# EAGLE design usb2rs232esp (EAGLE 6.6.0)
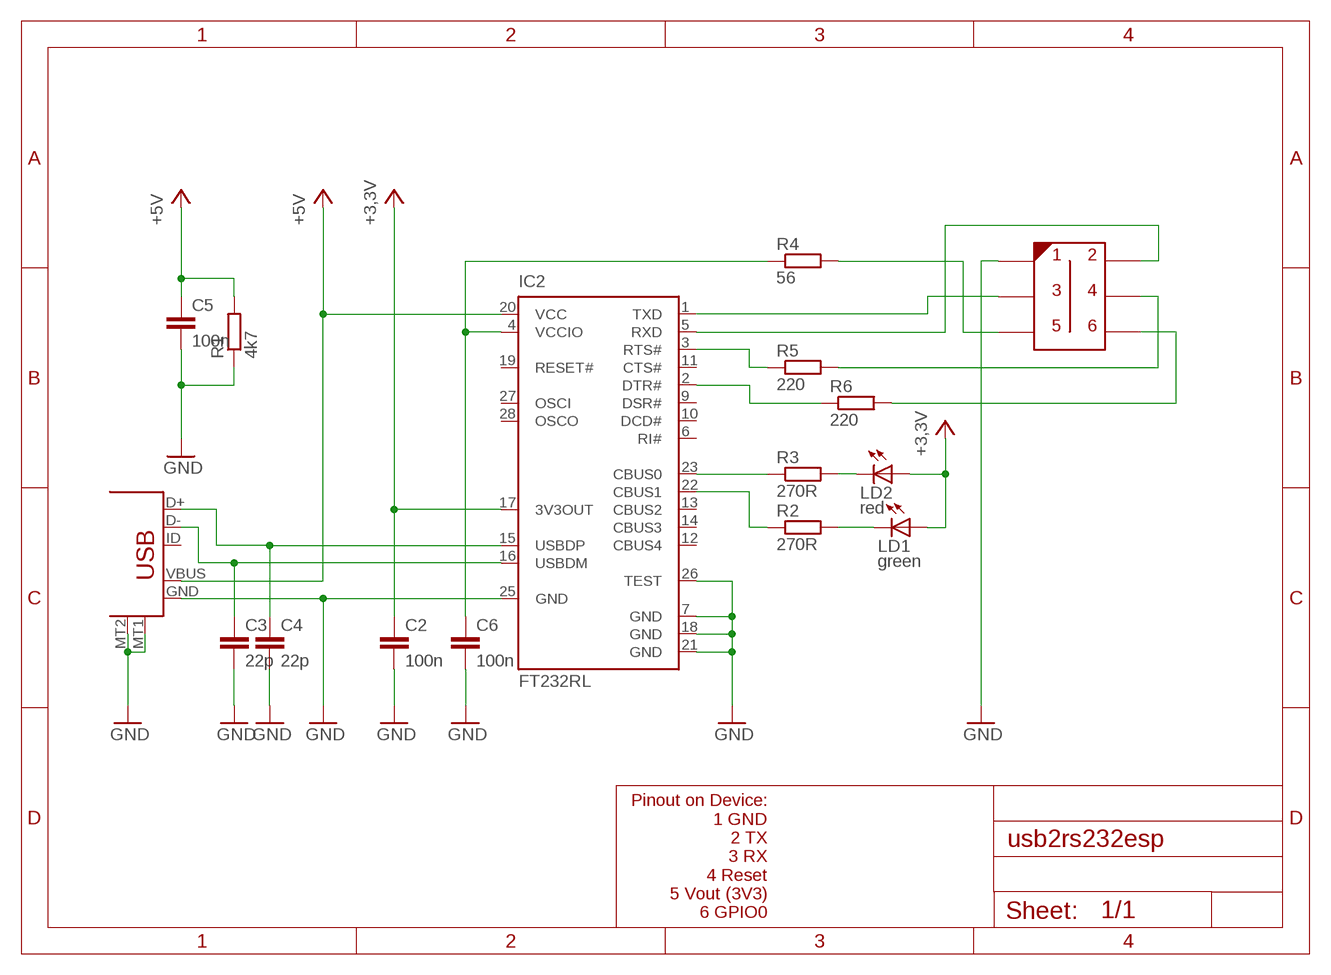
[diagram p0: schematic, sheet 1]

## Parts
C2  100n  C-EUC0603  [C0603]
C3  22p  C-EUC0603  [C0603]
C4  22p  C-EUC0603  [C0603]
C5  100n  C-EUC0603  [C0603]
C6  100n  C-EUC0603  [C0603]
IC2  FT232RL  [SSOP28]
LD1  green  LEDCHIP-LED0603  [CHIP-LED0603]
LD2  red  LEDCHIP-LED0603  [CHIP-LED0603]
R1  4k7  R-EU_R0603  [R0603]
R2  270R  R-EU_R0603  [R0603]
R3  270R  R-EU_R0603  [R0603]
R4  56  R-EU_R0603  [R0603]
R5  220  R-EU_R0603  [R0603]
R6  220  R-EU_R0603  [R0603]
U$3  AVR-ISP-6-EDGE  [6PAD_ISP]
U$40  USB-B  [USB-MICROB]

## Nets
+3,3V: C2.1 IC2.17(3V3OUT) LD1.A LD2.A
+5V [pwr]: C5.1 IC2.20(VCC) R1.2 U$40.VBUS
GND [pwr]: C2.2 C3.2 C4.2 C5.2 C6.2 IC2.7(GND) IC2.18(GND) IC2.21(GND) IC2.25(GND) IC2.26(TEST) R1.1 U$3.MISO U$40.GND U$40.MT1 U$40.MT2
N$1: IC2.23(CBUS0) R3.1
N$2: IC2.22(CBUS1) R2.1
N$3: C4.1 IC2.15(USBDP) U$40.D+
N$4: C3.1 IC2.16(USBDM) U$40.D-
N$5: C6.1 IC2.4(VCCIO) R4.1
N$6: LD1.C R2.2
N$7: LD2.C R3.2
N$8: R4.2 U$3.RST
N$9: R5.2 U$3.MOSI
N$10: R6.2 U$3.GND
N$11: IC2.5(RXD) U$3.VCC
N$12: IC2.1(TXD) U$3.SCK
N$13: IC2.3(RTS#) R5.1
N$14: IC2.2(DTR#) R6.1
Unconnected: IC2.6(RI#) IC2.9(DSR#) IC2.10(DCD#) IC2.11(CTS#) IC2.12(CBUS4) IC2.13(CBUS2) IC2.14(CBUS3) IC2.19(RESET#) IC2.27(OSCI) IC2.28(OSCO) U$40.ID

## Notes on the sheet
- 1 | 2
- 3 | 4
- 5 | 6
- Pinout on Device:
  1 GND
  2 TX
  3 RX
  4 Reset
  5 Vout (3V3)
  6 GPIO0

## Library data of the parts
C2-C6 = rcl:C-EU: CAPACITOR, European symbol
IC2 = ftdichip:FT232R: Source: http://www.ftdichip.com/Documents/DataSheets/DS_FT232R_v104.pdf
LD1 LD2 = led:LED: LED OSRAM: - CHIPLED LG R971, LG N971, LY N971, LG Q971, LY Q971, LO R971, LY R971 LH N974, LH R974 LS Q976, LO Q976, LY Q976 LO Q996 - Hyper CHIPLED LW Q18S LB Q993, LB Q99A, LB R99A - SideLED LS A670, LO A670, LY A670, LG A670, LP A670 LB A673, LV A673, LT A673, LW A673 LH A674 LY A675 LS A676, LA A676, LO A676, LY A676, LW A676 LS A679, LY A679, LG A679 - Hyper Micro SIDELED® LS Y876, LA Y876, LO Y876, LY Y876 LT Y87S - SmartLED LW L88C, LW L88S LB L89C, LB L89S, LG L890 LS L89K, LO L89K, LY L89K LS L896, LA L896, LO L896, LY L896 - TOPLED LS T670, LO T670, LY T670, LG T670, LP T670 LSG T670, LSP T670, LSY T670, LOP T670, LYG T670 LG T671, LOG T671, LSG T671 LB T673, LV T673, LT T673, LW T673 LH T674 LS T676, LA T676, LO T676, LY T676, LB T676, LH T676, LSB T676, LW T676 LB T67C, LV T67C, LT T67C, LS T67K, LO T67K, LY T67K, LW E67C LS E67B, LA E67B, LO E67B, LY E67B, LB E67C, LV E67C, LT E67C LW T67C LS T679, LY T679, LG T679 LS T770, LO T770, LY T770, LG T770, LP T770 LB T773, LV T773, LT T773, LW T773 LH T774 LS E675, LA E675, LY E675, LS T675 LS T776, LA T776, LO T776, LY T776, LB T776 LHGB T686 LT T68C, LB T68C - Hyper Mini TOPLED® LB M676 - Mini TOPLED Santana® LG M470 LS M47K, LO M47K, LY M47K Source: http://www.osram.convergy.de/
R1-R6 = rcl:R-EU_: RESISTOR, European symbol
U$3 = avr-7:AVR-ISP-6-EDGE: 6 pin edge connector for ISP with ATMEL MCUs. Developed by Craig Moates (craig at moates dot net). Library by David Blundell (blundar at gmail dot com). Often, even a 6 pin header is really inconvenient for board layout and/or production. This SMD-only header is our de-facto standard for using an edge connector for programming with the help of a 6pin/10pin to edge card adapter.
U$40 = sid:USB-B

## Net classes
0 default: width 0.152 mm, drill 0.305 mm, clearance 0.152 mm
1 pwr: width 0.152 mm, drill 0.305 mm, clearance 0.152 mm

## Board
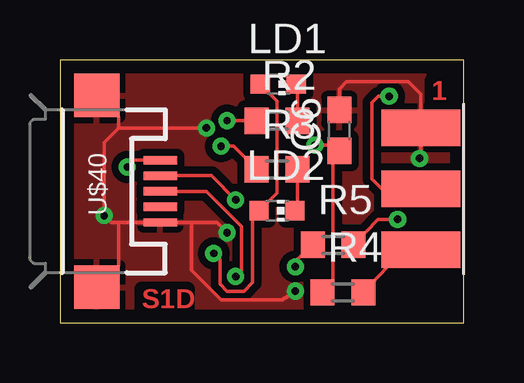
[diagram p1: board, top side]
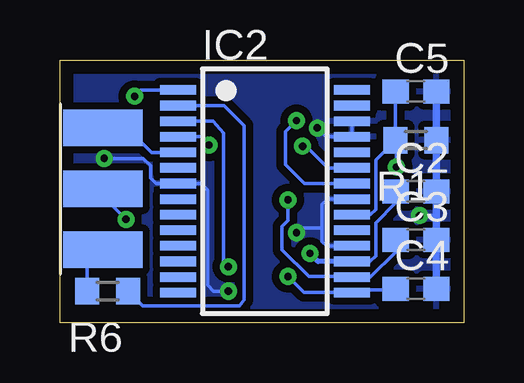
[diagram p2: board, bottom side, seen from below]

Size 16.84 x 10.96 mm. Coordinates in mm from the lower left corner, seen from the top.
Outline: 0,0 16.84,0 16.84,10.96 0,10.96 0,0
Copper layers (1*16): Top 0.035mm / dielectric 1.5mm / Bottom 0.035mm
Design rules "default *": minimum track width 6mil, minimum drill 12mil, track to track 6mil, track to pad 6mil, pad to pad 6mil, via to via 6mil, smd to smd 6mil, copper to edge 22mil, drill to drill 8mil, minimum pad ring 10mil, minimum via ring 8mil, stop-mask expansion 4mil, vias tented up to drill 12mil, thermal gap 10mil

### Footprints (pad centres in the part's own frame; a part is rotated, then mirrored left to right if it is on the bottom)
C0603 = smd 1.1 x 1: 1 -0.85,0; 2 0.85,0
SSOP28 = smd 0.4 x 1.5: 1 -4.225,-3.625; 2 -3.575,-3.625; 3 -2.925,-3.625; 4 -2.275,-3.625; 5 -1.625,-3.625; 6 -0.975,-3.625; 7 -0.325,-3.625; 8 0.325,-3.625; 9 0.975,-3.625; 10 1.625,-3.625; 11 2.275,-3.625; 12 2.925,-3.625; 13 3.575,-3.625; 14 4.225,-3.625; 15 4.225,3.625; 16 3.575,3.625; 17 2.925,3.625; 18 2.275,3.625; 19 1.625,3.625; 20 0.975,3.625; 21 0.325,3.625; 22 -0.325,3.625; 23 -0.975,3.625; 24 -1.625,3.625; 25 -2.275,3.625; 26 -2.925,3.625; 27 -3.575,3.625; 28 -4.225,3.625
CHIP-LED0603 = smd 0.8 x 0.8: A 0,-0.75; C 0,0.75
R0603 = smd 1 x 1.1: 1 -0.85,0; 2 0.85,0
6PAD_ISP = smd 1.524 x 3.302 bottom: GND 2.54,0; MOSI 0,0; VCC -2.54,0 | smd 1.524 x 3.302: MISO -2.54,0; RST 2.54,0; SCK 0,0
USB-MICROB = smd 0.35 x 1.4: D+ 0,2.65; D- -0.65,2.65; GND 1.3,2.65; ID 0.65,2.65; VBUS -1.3,2.65 | smd 1.8 x 1.9: MT1 -4,0; MT2 4,0

### Placement (x,y rotation side)
C2  1.99,5.48 0 bottom
C3  1.99,3.45 0 bottom
C4  1.99,1.42 0 bottom
C5  1.99,9.65 0 bottom
C6  11.65,8.02 90 top
IC2  8.29,5.48 270 bottom
LD1  9.11,9.95 270 top
LD2  9.06,4.67 270 top
R1  1.99,7.62 180 bottom
R2  9.06,8.43 0 top
R3  9.06,6.4 0 top
R4  11.8,1.27 0 top
R5  11.39,3.25 0 top
R6  14.85,1.32 180 bottom
U$3  15.05,5.58 270 top
U$40  1.54,5.48 270 top

### Tracks (layer width: path | path; a pad name or v marks a point on that pad's centre or on a via)
+3,3V  (via drill 0.3)
  Top 0.152: LD1.A 9.06,9.25 9.06,5.42 LD2.A 8.04,4.4 8.04,1.67 7.68,1.32 6.97,1.32 6.67,1.62 6.67,2.64 v6.41,2.89
  Bottom 0.152: IC2.17 3.9,2.56 3.67,2.79 3.67,4.16 2.84,4.99 C2.1
  Bottom 0.203: IC2.17 6.08,2.56 v6.41,2.89
+5V  (via drill 0.3)
  Top 0.152: U$40.VBUS 3.09,6.78 v2.81,6.5
  Bottom 0.152: R1.2 C5.1 | IC2.20 3.88,4.51 3.67,4.72 3.67,6.79 R1.2 | v2.81,6.5 2.81,7.58 R1.2
GND  (via drill 0.3)
  Top 0.152: C6.2 11.65,9.75 11.95,10.05 14.54,10.05 15.05,9.55 U$3.MISO 15.05,6.9 v15,6.85 | 2.45,4.18 U$40.GND 5.5,4.18 | 2.45,4.18 2.13,4.18 v1.84,4.47 1.84,7.51 2.45,8.12 | v6.97,3.75 6.55,4.18 5.5,4.18 | v6.11,8.12 2.45,8.12 | U$40.MT1 2.45,8.57 2.45,8.12 | U$40.MT2 2.45,2.4 2.45,4.18 | v9.82,1.32 9.26,0.96 6.72,0.96 5.5,2.18 5.5,4.18
  Bottom 0.152: 5.91,3.96 5.91,3.4 5.7,3.2 4.68,3.2 IC2.18 | 5.91,3.96 5.91,4.92 5.67,5.16 IC2.21 4.65,5.18 | IC2.25 4.66,7.77 | IC2.26 IC2.25 | v6.97,3.75 6.77,3.96 5.91,3.96 | IC2.7 11.94,5.79 | v1.84,4.47 1.2,4.47 1.14,4.41 | IC2.7 12.83,5.81 13.07,6.04 13.07,6.55 13.37,6.85 v15,6.85 | IC2.25 5.74,7.76 v6.11,8.12 | IC2.7 10.96,5.81 10.68,5.53 10.68,1.57 10.43,1.32 v9.82,1.32
  Bottom 0.305: C5.2 R1.1 C2.2 1.14,4.41 C3.2 C4.2
  pour Top (isolate 0.305): 0.11,10.87 0.11,0.1 16.83,0.1 16.83,10.87
  pour Bottom (isolate 0.305): 0.06,10.87 0.11,0.1 16.83,0.1 16.78,10.87
N$1  (via drill 0.3)
  Top 0.152: v6.72,7.36 7.24,7.36 R3.1
  Bottom 0.152: IC2.23 5.66,6.46 6.72,7.51 v6.72,7.36
N$2  (via drill 0.3)
  Top 0.152: v6.97,8.43 R2.1
  Bottom 0.152: IC2.22 6.64,5.81 7.43,6.6 7.43,7.97 v6.97,8.43
N$3  (via drill 0.3)
  Top 0.152: U$40.D+ 6.11,5.48 7.58,4.01 7.58,2.18 v7.33,1.93
  Bottom 0.152: C4.1 2.9,1.37 4.56,1.37 IC2.15 6.67,1.27 v7.33,1.93
N$4  (via drill 0.3)
  Top 0.152: U$40.D- 6.32,6.13 v7.33,5.13
  Bottom 0.152: v7.33,5.13 7.33,4.26 7.58,4.01 7.58,3.04 6.46,1.93 4.69,1.93 IC2.16 3.89,1.91 2.86,2.94 C3.1
N$5  (via drill 0.3)
  Top 0.152: 11.24,6.77 11.39,6.92 | v10.63,7.41 11.41,7.41 C6.1 11.39,6.92 | R4.1 11.39,1.71 11.39,6.92
  Bottom 0.152: IC2.4 10.95,7.76 v10.63,7.41
N$6
  Top 0.152: LD1.C 9.96,9.85 9.91,9.8 R2.2
N$7
  Top 0.152: R3.2 9.91,6.35 9.91,4.77 LD2.C
N$8
  Top 0.152: U$3.RST 14.33,3.04 R4.2
N$9  (via drill 0.3)
  Top 0.152: v14.08,4.31 13.26,4.31 R5.2
  Bottom 0.152: U$3.MOSI 15.05,5.28 v14.08,4.31
N$10
  Bottom 0.152: R6.2 15.7,2.4 U$3.GND
N$11
  Bottom 0.152: IC2.5 13.02,7.11 14.03,8.12 U$3.VCC
N$12  (via drill 0.3)
  Top 0.152: U$3.SCK 13.42,5.58 13.02,5.99 13.02,9.19 13.27,9.44 v13.73,9.44
  Bottom 0.152: v13.73,9.44 13.47,9.71 IC2.1
N$13  (via drill 0.3)
  Top 0.152: 10.63,3.39 R5.1 9.82,2.57 v9.82,2.33
  Bottom 0.152: IC2.3 10.46,8.41 10.02,7.92 10.02,2.54 v9.82,2.33
N$14
  Bottom 0.152: IC2.2 9.99,9.06 9.16,8.22 9.16,0.96 9.36,0.71 13.39,0.71 R6.1

### Text on the board
Top: 1 | S1D